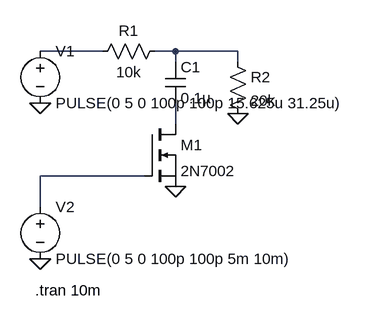
[diagram p0: schematic Draft2.asc]
Draft2.asc, the LTspice schematic file:
Version 4
SHEET 1 880 680
WIRE 144 288 48 288
WIRE 256 288 224 288
WIRE 352 288 256 288
WIRE 256 304 256 288
WIRE 352 304 352 288
WIRE 256 400 256 368
WIRE 208 480 48 480
WIRE 48 528 48 480
FLAG 48 368 0
FLAG 48 608 0
FLAG 256 496 0
FLAG 352 384 0
SYMBOL voltage 48 272 R0
SYMATTR InstName V1
SYMATTR Value PULSE(0 5 0 100p 100p 15.625u 31.25u)
SYMBOL voltage 48 512 R0
SYMATTR InstName V2
SYMATTR Value PULSE(0 5 0 100p 100p 5m 10m)
SYMBOL res 240 272 R90
WINDOW 0 0 56 VBottom 2
WINDOW 3 32 56 VTop 2
SYMATTR InstName R1
SYMATTR Value 10k
SYMBOL cap 240 304 R0
SYMATTR InstName C1
SYMATTR Value 0.1µ
SYMBOL nmos 208 400 R0
SYMATTR InstName M1
SYMATTR Value 2N7002
SYMBOL res 336 288 R0
SYMATTR InstName R2
SYMATTR Value 20k
TEXT 40 656 Left 2 !.tran 10m

The netlist it stands for:
* Draft2.asc
V1 N001 0 PULSE(0 5 0 100p 100p 15.625u 31.25u)
V2 N004 0 PULSE(0 5 0 100p 100p 5m 10m)
R1 N002 N001 10k
C1 N002 N003 0.1µ
M1 N003 N004 0 0 2N7002
R2 N002 0 20k
.model NMOS NMOS
.model PMOS PMOS
.lib standard.mos
.tran 10m
.backanno
.end